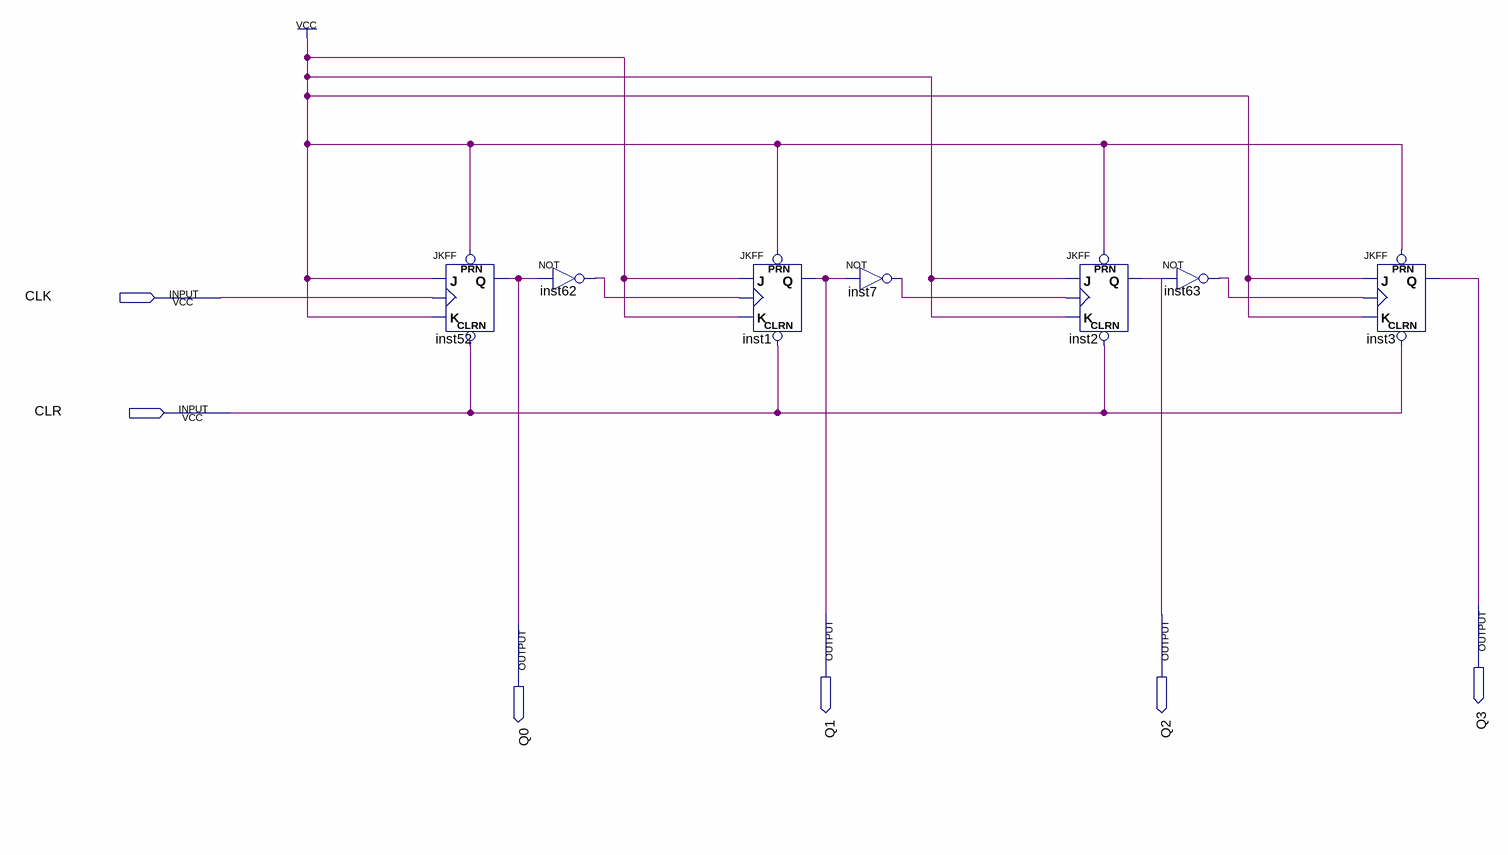
[diagram p0: schematic sheet]
// Quartus schematic ModDieciseis.bdf as structural Verilog: 7 symbols, 6 pins
module ModDieciseis (
  input  CLK,
  input  CLR,
  output Q3,
  output Q1,
  output Q2,
  output Q0
);

  wire inst7_out, inst62_out, inst63_out;

  JKFF inst52 (.PRN(1'b1), .CLRN(CLR), .K(1'b1), .J(1'b1), .CLK(CLK), .Q(Q0));
  not inst62 (inst62_out, Q0);
  JKFF inst1 (.PRN(1'b1), .CLRN(CLR), .K(1'b1), .J(1'b1), .CLK(inst62_out), .Q(Q1));
  not inst7 (inst7_out, Q1);
  JKFF inst2 (.PRN(1'b1), .CLRN(CLR), .K(1'b1), .J(1'b1), .CLK(inst7_out), .Q(Q2));
  not inst63 (inst63_out, Q2);
  JKFF inst3 (.PRN(1'b1), .CLRN(CLR), .K(1'b1), .J(1'b1), .CLK(inst63_out), .Q(Q3));
endmodule
